# Altium schematic sheet 07-XORStatusLed.SchDoc
size A4; DocumentNumber: 7; SheetNumber: 7; SheetTotal: 26
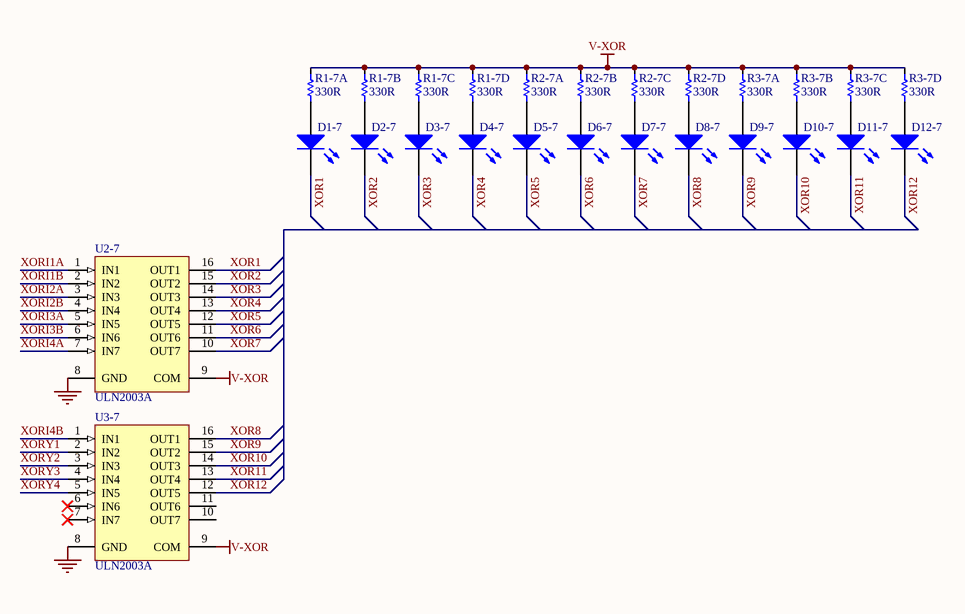
[diagram p0: 07-XORStatusLed.SchDoc]

## Parts
D1-7  LED  [LED-0805]  (value not drawn)
D2-7  LED  [LED-0805]  (value not drawn)
D3-7  LED  [LED-0805]  (value not drawn)
D4-7  LED  [LED-0805]  (value not drawn)
D5-7  LED  [LED-0805]  (value not drawn)
D6-7  LED  [LED-0805]  (value not drawn)
D7-7  LED  [LED-0805]  (value not drawn)
D8-7  LED  [LED-0805]  (value not drawn)
D9-7  LED  [LED-0805]  (value not drawn)
D10-7  LED  [LED-0805]  (value not drawn)
D11-7  LED  [LED-0805]  (value not drawn)
D12-7  LED  [LED-0805]  (value not drawn)
R1-7  330R  [R-Array-0603-4]  (parts A,B,C,D of 4)
R2-7  330R  [R-Array-0603-4]  (parts A,B,C,D of 4)
R3-7  330R  [R-Array-0603-4]  (parts A,B,C,D of 4)
U2-7  ULN2003A  [SOIC-16]
U3-7  ULN2003A  [SOIC-16]

## Nets
GND: U2-7.8(GND) U3-7.8(GND)
V-XOR: R1-7.2 R1-7.4 R1-7.6 R1-7.8 R2-7.2 R2-7.4 R2-7.6 R2-7.8 R3-7.2 R3-7.4 R3-7.6 R3-7.8 U2-7.9(COM) U3-7.9(COM)
XOR1: D1-7.2(K) U2-7.16(OUT1)
XOR2: D2-7.2(K) U2-7.15(OUT2)
XOR3: D3-7.2(K) U2-7.14(OUT3)
XOR4: D4-7.2(K) U2-7.13(OUT4)
XOR5: D5-7.2(K) U2-7.12(OUT5)
XOR6: D6-7.2(K) U2-7.11(OUT6)
XOR7: D7-7.2(K) U2-7.10(OUT7)
XOR8: D8-7.2(K) U3-7.16(OUT1)
XOR9: D9-7.2(K) U3-7.15(OUT2)
XOR10: D10-7.2(K) U3-7.14(OUT3)
XOR11: D11-7.2(K) U3-7.13(OUT4)
XOR12: D12-7.2(K) U3-7.12(OUT5)
XORI1A: U2-7.1(IN1)
XORI1B: U2-7.2(IN2)
XORI2A: U2-7.3(IN3)
XORI2B: U2-7.4(IN4)
XORI3A: U2-7.5(IN5)
XORI3B: U2-7.6(IN6)
XORI4A: U2-7.7(IN7)
XORI4B: U3-7.1(IN1)
XORY1: U3-7.2(IN2)
XORY2: U3-7.3(IN3)
XORY3: U3-7.4(IN4)
XORY4: U3-7.5(IN5)
NetD1-7_1: D1-7.1(A) R1-7.1
NetD2-7_1: D2-7.1(A) R1-7.3
NetD3-7_1: D3-7.1(A) R1-7.5
NetD4-7_1: D4-7.1(A) R1-7.7
NetD5-7_1: D5-7.1(A) R2-7.1
NetD6-7_1: D6-7.1(A) R2-7.3
NetD7-7_1: D7-7.1(A) R2-7.5
NetD8-7_1: D8-7.1(A) R2-7.7
NetD9-7_1: D9-7.1(A) R3-7.1
NetD10-7_1: D10-7.1(A) R3-7.3
NetD11-7_1: D11-7.1(A) R3-7.5
NetD12-7_1: D12-7.1(A) R3-7.7

Not connected (* = marked no-connect by the designer): U3-7 6(IN6)* 7(IN7)* 10(OUT7) 11(OUT6)

## Library data of the parts
D1-7 D2-7 D3-7 D4-7 D5-7 D6-7 D7-7 D8-7 D9-7 D10-7 D11-7 D12-7 = LED2: Typical RED, GREEN, YELLOW, AMBER GaAs LED; Published: 8-Jun-2000; LatestRevisionDate: 17-Jul-2002; LatestRevisionNote: Re-released for DXP Platform.; PackageVersion: Feb-2002; PackageReference: 3.2X1.6X1.1; Publisher: Altium Limited; PackageDescription: SM LED; 2 Flat Leads
R1-7 R2-7 R3-7 = Res Array 4: RES ARRAY 4 RES 330 OHM 1206; Manufacturer: Panasonic Electronic Components; Manufacturer Part Number: EXB-38V331JV; Digi-Key Part Number: Y9331TR-ND; Link: http://www.digikey.com/product-detail/en/EXB-38V331JV/Y9331TR-ND/256525
U2-7 U3-7 = ULN2003A: High-Voltage, High-Current Darlington Array; Published: 13-Oct-2000; LatestRevisionDate: 06-Jun-2005; LatestRevisionNote: Stylized 3D Model Added.; DatasheetVersion: 1998; PackageVersion: 1998; PackageReference: A16; Publisher: Altium Limited; PackageDescription: DIP; 16 Leads; Row Spacing 7.62 mm; Pitch 2.54 mm; Code_JEDEC: MS-001-BB; ComponentLink1Description: Manufacturer Link; ComponentLink1URL: http://www.allegromicro.com/